# EAGLE design W681A (EAGLE 6.6.0)
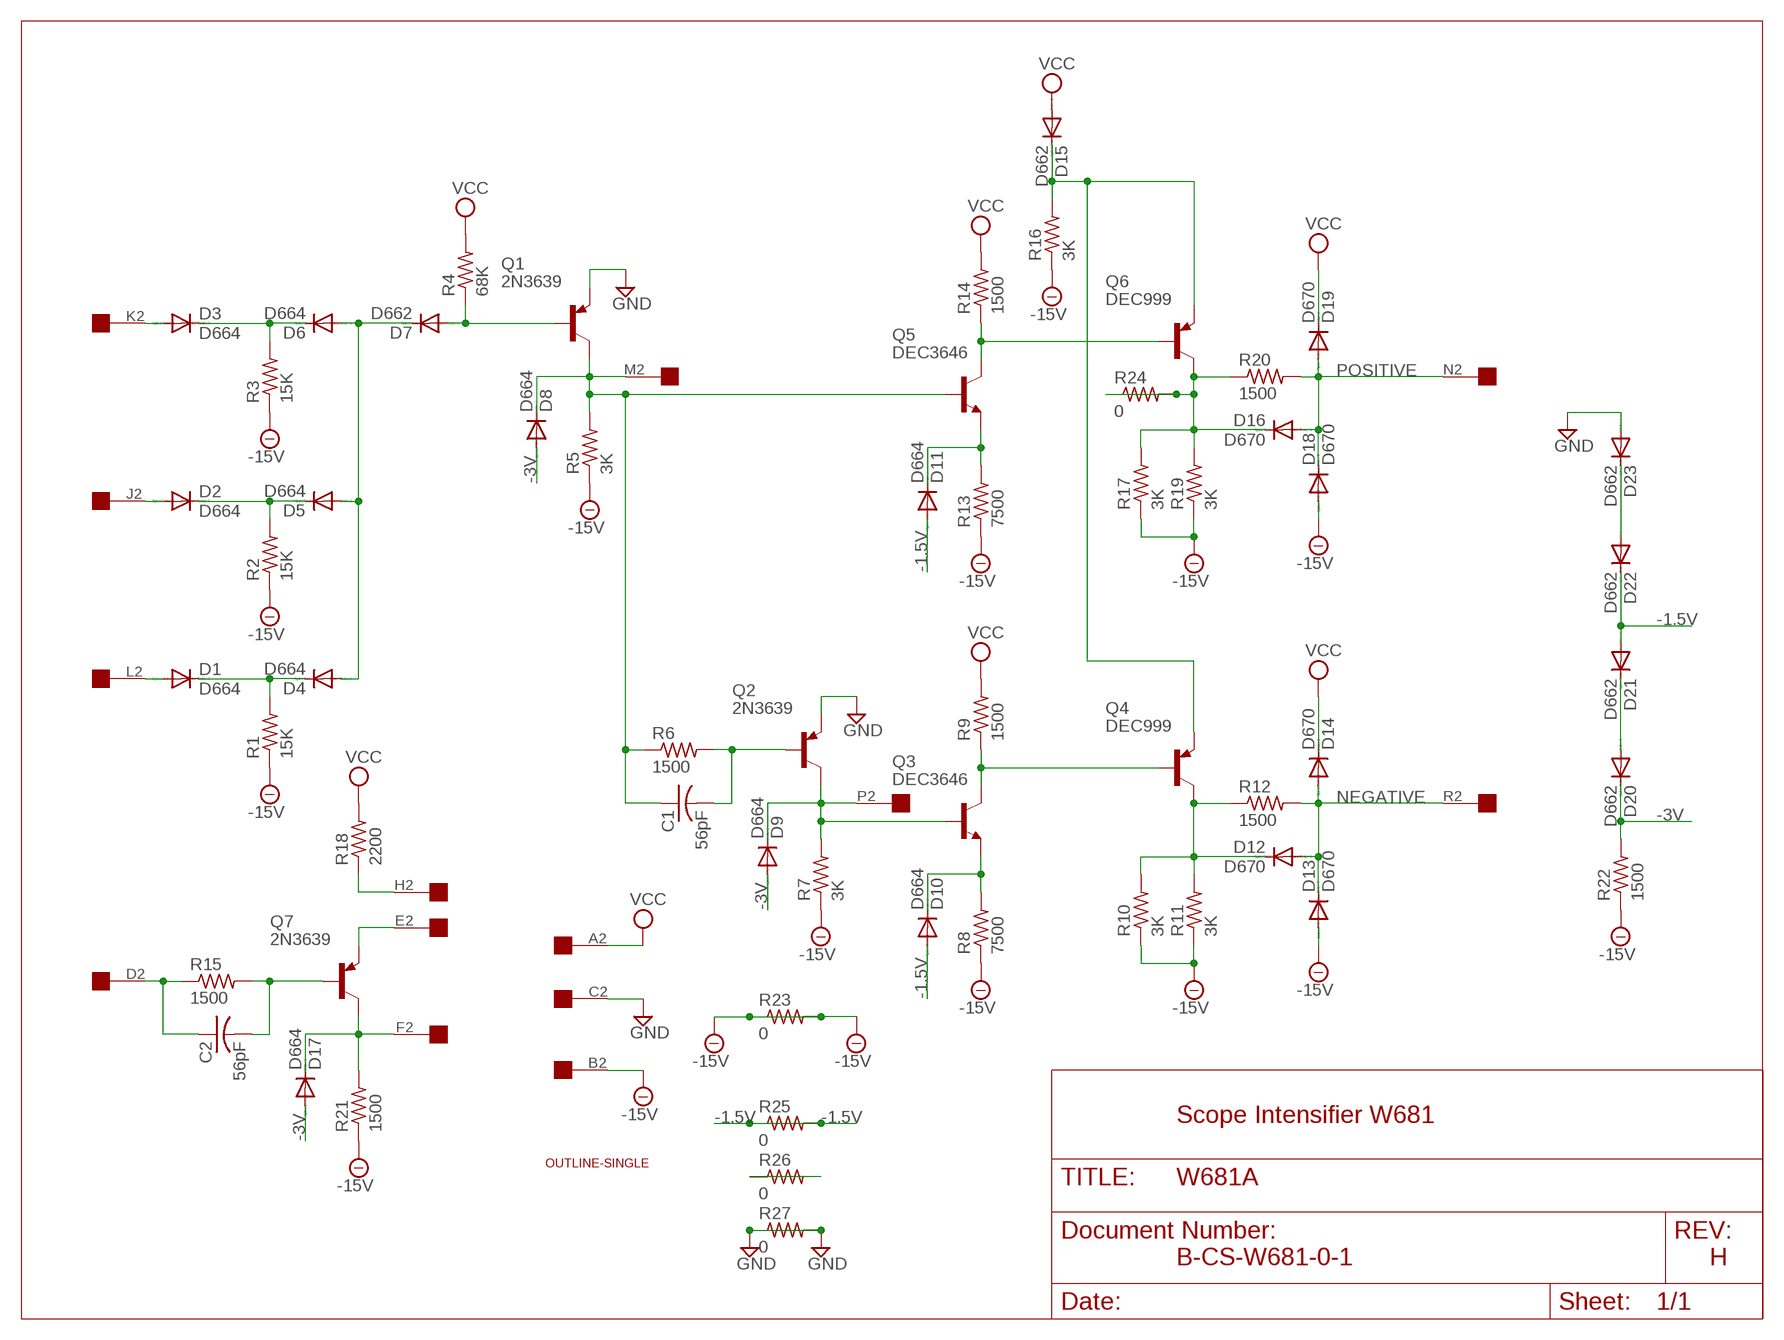
[diagram p0: schematic, sheet 1]

## Parts
C1  56pF  C-US  [C063-025X075]
C2  56pF  C-US  [C063-025X075]
D1  D664  DIODE-DO35-10  [DO35-10]
D2  D664  DIODE-DO35-10  [DO35-10]
D3  D664  DIODE-DO35-10  [DO35-10]
D4  D664  DIODE-DO35-10  [DO35-10]
D5  D664  DIODE-DO35-10  [DO35-10]
D6  D664  DIODE-DO35-10  [DO35-10]
D7  D662  DIODE-DO35-10  [DO35-10]
D8  D664  DIODE-DO35-10  [DO35-10]
D9  D664  DIODE-DO35-10  [DO35-10]
D10  D664  DIODE-DO35-10  [DO35-10]
D11  D664  DIODE-DO35-10  [DO35-10]
D12  D670  DIODE-DO35-10  [DO35-10]
D13  D670  DIODE-DO35-10  [DO35-10]
D14  D670  DIODE-DO35-10  [DO35-10]
D15  D662  DIODE-DO35-10  [DO35-10]
D16  D670  DIODE-DO35-10  [DO35-10]
D17  D664  DIODE-DO35-10  [DO35-10]
D18  D670  DIODE-DO35-10  [DO35-10]
D19  D670  DIODE-DO35-10  [DO35-10]
D20  D662  DIODE-DO35-10  [DO35-10]
D21  D662  DIODE-DO35-10  [DO35-10]
D22  D662  DIODE-DO35-10  [DO35-10]
D23  D662  DIODE-DO35-10  [DO35-10]
Q1  2N3639  -PNP-TO5  [TO5]
Q2  2N3639  -PNP-TO5  [TO5]
Q3  DEC3646  -NPN-TO5  [TO5]
Q4  DEC999  -PNP-TO5  [TO5]
Q5  DEC3646  -NPN-TO5  [TO5]
Q6  DEC999  -PNP-TO5  [TO5]
Q7  2N3639  -PNP-TO5  [TO5]
R1  15K  R-US_0207/10  [0207/10]
R2  15K  R-US_0207/10  [0207/10]
R3  15K  R-US_0207/10  [0207/10]
R4  68K  R-US_0207/10  [0207/10]
R5  3K  R-US_0207/10  [0207/10]
R6  1500  R-US_0207/10  [0207/10]
R7  3K  R-US_0207/10  [0207/10]
R8  7500  R-US_0207/10  [0207/10]
R9  1500  R-US_0207/10  [0207/10]
R10  3K  R-US_0207/10  [0207/10]
R11  3K  R-US_0207/10  [0207/10]
R12  1500  R-US_0207/10  [0207/10]
R13  7500  R-US_0207/10  [0207/10]
R14  1500  R-US_0207/10  [0207/10]
R15  1500  R-US_0207/10  [0207/10]
R16  3K  R-US_0207/10  [0207/10]
R17  3K  R-US_0207/10  [0207/10]
R18  2200  R-US_0207/10  [0207/10]
R19  3K  R-US_0207/10  [0207/10]
R20  1500  R-US_0207/10  [0207/10]
R21  1500  R-US_0207/10  [0207/10]
R22  1500  R-US_0207/10  [0207/10]
R23  0  R-US_0207/10  [0207/10]
R24  0  R-US_0207/10  [0207/10]
R25  0  R-US_0207/10  [0207/10]
R26  0  R-US_0207/10  [0207/10]
R27  0  R-US_0207/10  [0207/10]
U$1  OUTLINE-SINGLE  [SINGLE]
U$2  EDGE-1  [EDGE-CON1]

## Nets
-1.5V [supply]: D10.A D11.A D21.A D22.C R25.1 R25.2
-3V: D8.A D9.A D17.A D20.C R22.2
-15V [supply]: D13.A D18.A R1.1 R2.1 R3.1 R5.1 R7.1 R8.1 R10.1 R11.1 R13.1 R16.1 R17.1 R19.1 R21.1 R22.1 R23.1 R23.2 U$2.B2
GND [supply]: D23.A Q1.1(E) Q2.1(E) R27.1 R27.2 U$2.C2
N$1: D1.A U$2.L2
N$2: D2.A U$2.J2
N$3: D3.A U$2.K2
N$4: D1.C D4.C R1.2
N$5: D2.C D5.C R2.2
N$6: D3.C D6.C R3.2
N$7: D4.A D5.A D6.A D7.C
N$8: D7.A Q1.2(B) R4.1
N$9: C1.1 D8.C Q1.3(C) Q5.2(B) R5.2 R6.1 U$2.M2
N$10: C1.2 Q2.2(B) R6.2
N$11: D9.C Q2.3(C) Q3.2(B) R7.2 U$2.P2
N$12: Q3.3(C) Q4.2(B) R9.1
N$13: D10.C Q3.1(E) R8.2
N$14: D12.C Q4.3(C) R10.2 R11.2 R12.1
N$15: Q5.3(C) Q6.2(B) R14.1
N$16: D11.C Q5.1(E) R13.2
N$17: D15.C Q4.1(E) Q6.1(E) R16.2
N$18: D16.C Q6.3(C) R17.2 R19.2 R20.1 R24.1 R24.2
N$19: C2.1 R15.1 U$2.D2
N$20: C2.2 Q7.2(B) R15.2
N$21: D17.C Q7.3(C) R21.2 U$2.F2
N$22: Q7.1(E) U$2.E2
N$23: R18.1 U$2.H2
N$25: D20.A D21.C
N$26: D22.A D23.C
N$27: R26.1 R26.2
NEGATIVE: D12.A D13.C D14.A R12.2 U$2.R2
POSITIVE: D16.A D18.C D19.A R20.2 U$2.N2
VCC [supply]: D14.C D15.A D19.C R4.2 R9.2 R14.2 R18.2 U$2.A2
Unconnected: U$2.S2 U$2.T2 U$2.U2 U$2.V2

## Notes on the sheet
- Scope Intensifier W681
- B-CS-W681-0-1 | H

## Library data of the parts
C1 C2 = dec-con:C-US: Capacitors with funky DEC lead spacing.
D1-D23 = diode:DIODE-: DIODE
Q1 Q2 Q4 Q6 Q7 = transistor:*-PNP-: PNP Transistror
Q3 Q5 = transistor:*-NPN-: NPN Transistror BF959 corrected 2008.03.06
R1-R27 = rcl:R-US_: RESISTOR, American symbol
U$1 = dec-con:OUTLINE-*: Board outlines for DEC boards.
U$2 = dec-con:EDGE-1: Single-Sided DEC Edge Connector -- (side 2)

## Net classes
1 supply: width 0.813 mm

## Board
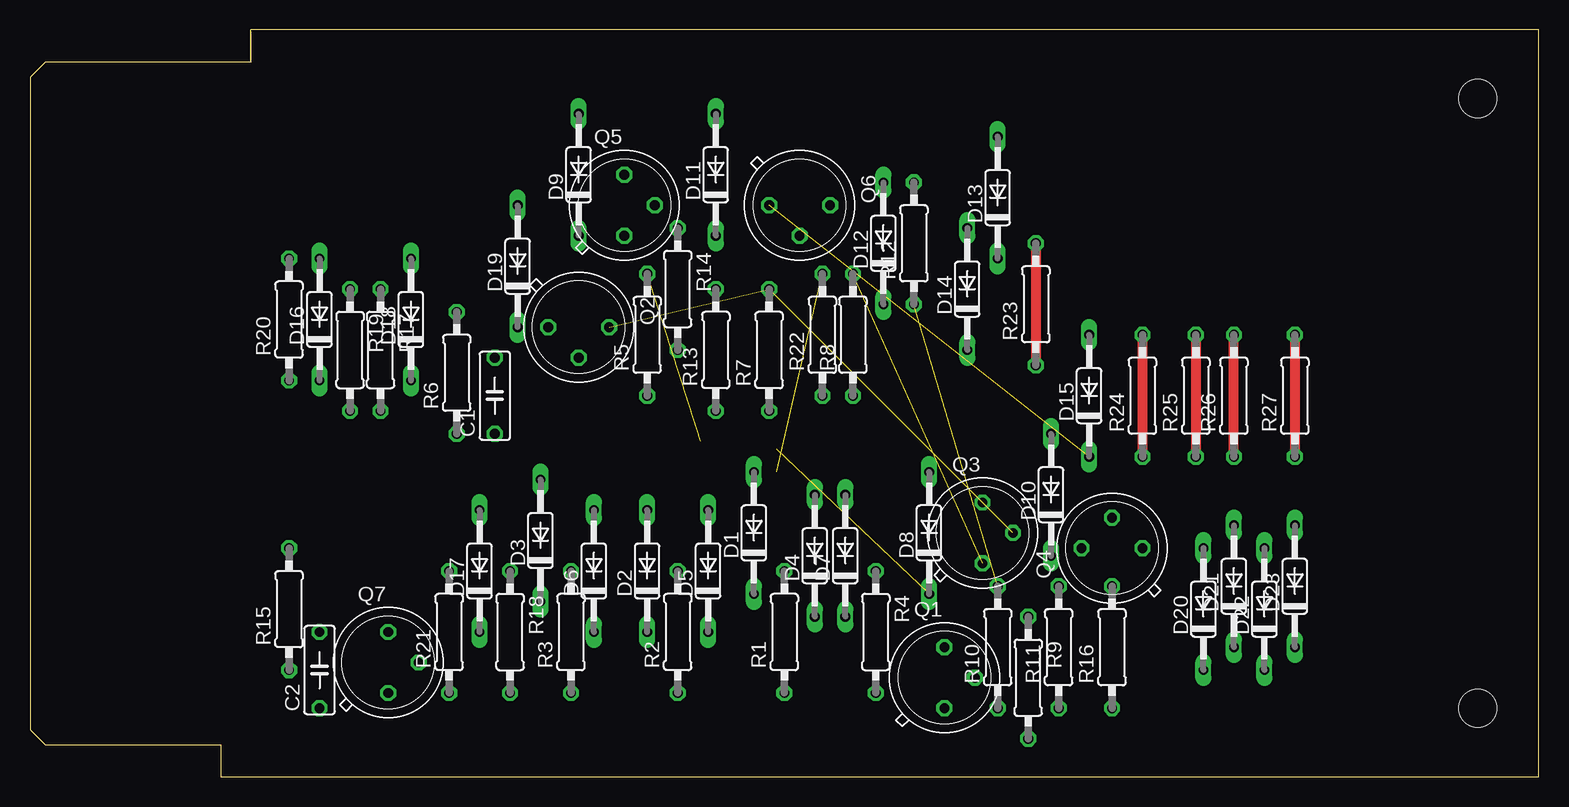
[diagram p1: board, top side]
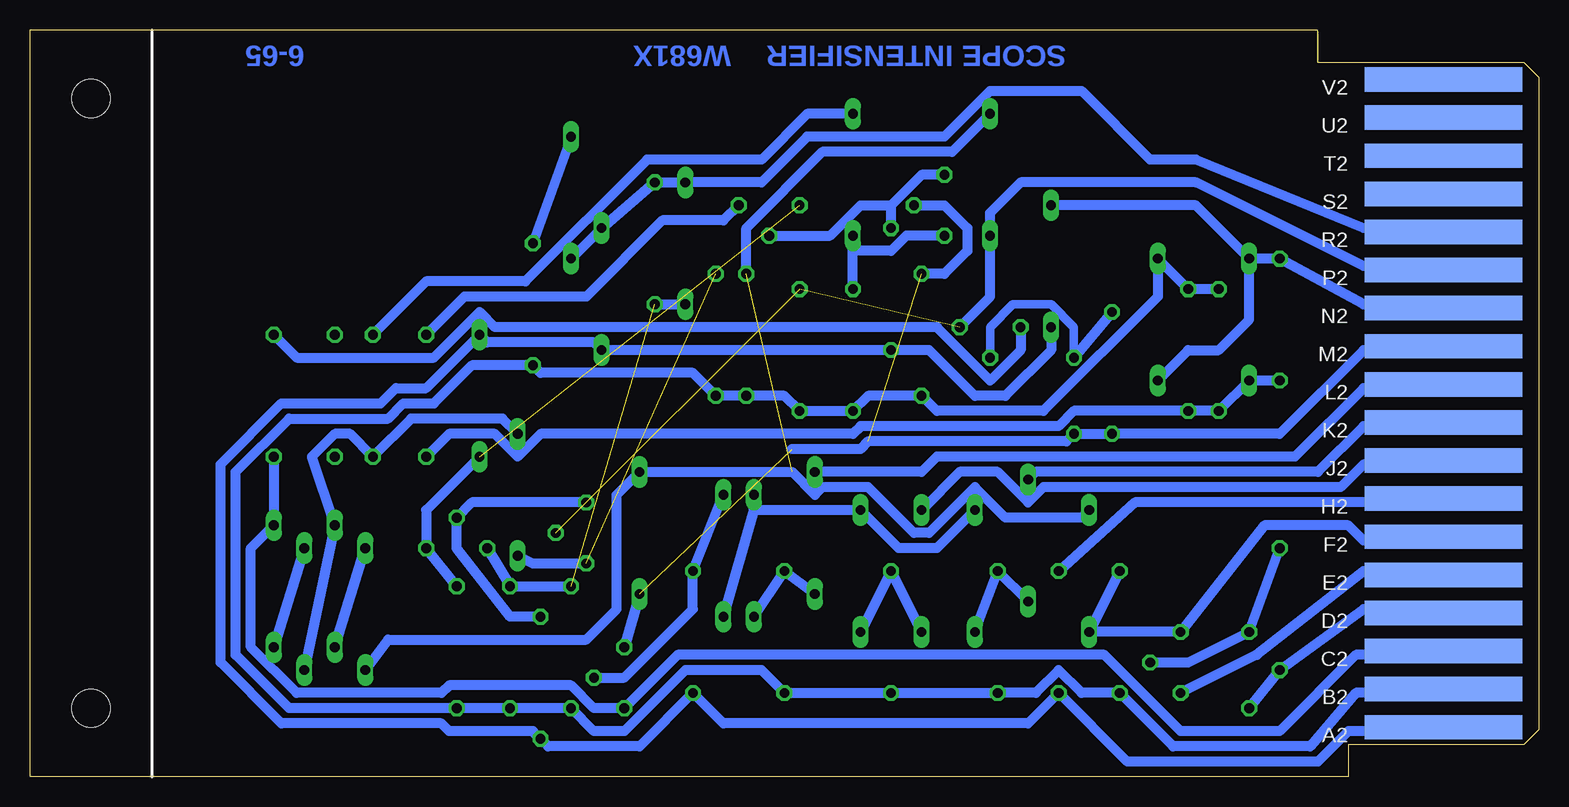
[diagram p2: board, bottom side, seen from below]

Size 125.73 x 62.23 mm. Coordinates in mm from the lower left corner, seen from the top.
Copper layers (1+16): Top 0.035mm / dielectric 1.5mm / Bottom 0.035mm
Design rules "16mils": minimum track width 16mil, minimum drill 32mil, track to track 15mil, track to pad 10mil, pad to pad 10mil, via to via 10mil, smd to smd 10mil, copper to edge 13mil, drill to drill 10mil, minimum pad ring 10mil, minimum via ring 8mil, stop-mask expansion 0mil, vias tented up to drill 0mil, thermal gap 10mil

### Footprints (pad centres in the part's own frame; a part is rotated, then mirrored left to right if it is on the bottom)
C063-025X075 = drill 0.813 octagon: 1 -2.54,0; 2 3.81,0
DO35-10 = drill 0.813 long: A 5.08,0; C -5.08,0
TO5 = drill 0.813 octagon: 1 0,-2.54; 2 2.54,0; 3 0,2.54
0207/10 = drill 0.813 octagon: 1 -5.08,0; 2 5.08,0
SINGLE = hole 3.175: 120.65,56.515; 120.65,5.715
EDGE-CON1 = smd 13.106 x 2.032 bottom: A2 7.938,4.128; B2 7.938,7.303; C2 7.938,10.477; D2 7.938,13.652; E2 7.938,16.828; F2 7.938,20.003; H2 7.938,23.177; J2 7.938,26.352; K2 7.938,29.527; L2 7.938,32.703; M2 7.938,35.877; N2 7.938,39.053; P2 7.938,42.227; R2 7.938,45.403; S2 7.938,48.578; T2 7.938,51.752; U2 7.938,54.928; V2 7.938,58.102

### Placement (x,y rotation side)
C1  38.74,31.11 90 top
C2  24.13,8.26 90 top
D1  60.33,20.32 90 top
D2  51.44,17.14 90 top
D3  42.55,19.68 90 top
D4  65.41,18.41 90 top
D5  56.52,17.14 90 top
D6  46.99,17.14 90 top
D7  67.95,18.41 90 top
D8  74.93,20.32 90 top
D9  45.72,50.16 90 top
D10  85.09,23.5 90 top
D11  57.15,50.16 90 top
D12  71.12,44.45 90 top
D13  80.65,48.26 90 top
D14  78.11,40.64 90 top
D15  88.27,31.75 90 top
D16  24.13,38.1 90 top
D17  37.47,17.14 90 top
D18  31.75,38.1 90 top
D19  40.64,42.55 90 top
D20  97.79,13.97 90 top
D21  100.33,15.88 90 top
D22  102.87,13.97 90 top
D23  105.41,15.88 90 top
Q1  76.2,8.26 0 top
Q2  45.72,37.47 270 top
Q3  79.38,20.32 0 top
Q4  90.17,19.05 90 top
Q5  49.53,47.62 0 top
Q6  64.14,47.62 270 top
Q7  29.85,9.53 0 top
R1  62.87,12.06 90 top
R2  53.98,12.06 90 top
R3  45.09,12.06 90 top
R4  70.49,12.06 270 top
R5  51.44,36.83 90 top
R6  35.56,33.66 90 top
R7  61.6,35.56 90 top
R8  68.58,36.83 90 top
R9  83.19,8.26 270 top
R10  80.65,10.79 90 top
R11  85.73,10.79 90 top
R12  73.66,44.45 90 top
R13  57.15,35.56 90 top
R14  53.98,40.64 270 top
R15  21.59,13.97 90 top
R16  90.17,10.79 90 top
R17  29.21,35.56 270 top
R18  40.01,12.06 270 top
R19  26.67,35.56 270 top
R20  21.59,38.1 90 top
R21  34.93,12.06 90 top
R22  66.04,36.83 90 top
R23  83.82,39.37 90 top
R24  92.71,31.75 90 top
R25  97.16,31.75 90 top
R26  100.33,31.75 90 top
R27  105.41,31.75 90 top
U$1  0,0 0 top
U$2  0,0 0 top

### Tracks (layer width: path | path; a pad name or v marks a point on that pad's centre or on a via)
-1.5V
  Top 0.813: R25.2 R25.1
  Bottom 0.813: D22.C D21.A 102.24,26.67 100.33,28.57 99.06,28.57 R25.1 93.98,29.84 86.36,29.84 D10.A | D11.A 60.96,55.24 64.77,51.44 74.3,51.44 84.46,41.27 92.71,41.27 R25.2
-3V  (1 unrouted)
  Bottom 0.813: D20.C 95.89,11.43 79.38,11.43 76.84,13.97 76.84,23.5 D8.A 62.23,25.4 60.33,23.5 59.69,24.13 55.88,24.13 52.07,20.32 50.8,20.32 46.99,24.13 44.45,21.59 38.1,21.59 D17.A | D9.A 48.9,52.07 59.69,52.07 66.04,45.72 R22.2
-15V
  Top 0.813: R23.2 R23.1
  Bottom 0.813: U$2.B2 8.26,6.99 15.24,6.99 19.05,2.54 30.48,2.54 R21.1 38.1,6.99 40.01,8.89 41.91,6.99 R3.1 R2.1 R1.1 64.77,8.89 71.12,8.89 76.2,3.81 78.74,3.81 R10.1 R11.1 R16.1 104.14,5.71 108.59,10.16 108.59,25.4 104.14,29.84 95.89,29.84 94.62,31.11 92.08,31.11 88.9,34.29 R23.1 83.19,33.66 70.49,33.66 R8.1 R22.1 62.87,31.75 R7.1 R13.1 55.88,31.75 R5.1 50.17,30.48 41.28,30.48 31.75,40.01 D18.A R17.1 R19.1 | D13.A R23.2
GND
  Top 0.813: R27.2 R27.1
  Bottom 0.813: U$2.C2 8.89,10.16 15.24,10.16 21.59,3.81 29.85,3.81 36.2,10.16 71.76,10.16 Q1.1 78.74,5.71 80.65,7.62 90.81,7.62 91.44,6.99 103.51,6.99 107.32,10.79 107.32,19.05 D23.A R27.1 | Q2.1 43.18,35.56 45.72,33.02 50.17,37.47 87,37.47 88.27,38.73 92.08,34.92 103.51,34.92 R27.2
N$1
  Bottom 0.813: U$2.L2 8.89,32.38 14.61,32.38 20.32,26.67 50.17,26.67 51.44,25.4 D1.A
N$2
  Bottom 0.813: U$2.J2 8.89,26.04 14.61,26.04 16.51,24.13 41.28,24.13 42.55,22.86 45.09,25.4 48.26,25.4 D2.A
N$3
  Bottom 0.813: U$2.K2 8.26,29.21 14.61,29.21 18.42,25.4 41.91,25.4 D3.A
N$4
  Bottom 0.813: D1.C R1.2 D4.C
N$5
  Bottom 0.813: D2.C R2.2 D5.C
N$6
  Bottom 0.813: D3.C R3.2 D6.C
N$7
  Bottom 0.813: 65.41,22.23 D7.C | D6.A 50.17,19.05 53.34,19.05 D5.A 65.41,22.23 | 65.41,22.23 D4.A
N$8
  Bottom 0.813: Q1.2 76.2,8.26 70.49,13.97 R4.1 D7.A
N$9  (2 unrouted)
  Bottom 0.813: D8.C Q1.3 | U$2.M2 8.89,35.56 14.61,35.56 21.59,28.57 R6.1 C1.1 39.37,27.94 55.88,27.94 56.52,27.3 62.23,27.3 | Q5.2 49.53,47.62 47.63,45.72 47.63,43.81 49.53,41.91 R5.2
N$10
  Bottom 0.711: C1.2 38.74,37.47 40.64,39.37 43.82,39.37 45.72,37.47 Q2.2
  Bottom 0.813: R6.2 C1.2
N$11  (2 unrouted)
  Bottom 0.813: U$2.P2 8.89,42.55 14.61,42.55 28.58,49.53 43.18,49.53 45.72,46.99 D9.C 45.72,40.01 Q2.3
N$12
  Bottom 0.813: Q3.3 88.9,22.86 Q4.2 90.17,19.05 85.73,13.34 R9.1
N$13  (1 unrouted)
  Bottom 0.813: D10.C 83.82,17.78 Q3.1
N$14  (1 unrouted)
  Bottom 0.813: R10.2 R11.2 Q4.3 | R12.1 D12.C
N$15
  Bottom 0.813: Q5.3 51.44,50.16 53.98,47.62 | R14.1 53.98,47.62 | Q6.2 59.06,45.09 56.52,47.62 53.98,47.62
N$16
  Bottom 0.813: Q5.1 52.71,45.09 53.98,43.81 57.15,43.81 | R13.2 57.15,43.81 | 57.15,43.81 D11.C
N$17  (1 unrouted)
  Bottom 0.813: R16.2 Q4.1 92.71,22.23 D15.C
N$18
  Top 0.813: R24.1 R24.2
  Bottom 0.813: R20.1 D16.C R19.2 R17.2 38.74,30.48 40.01,29.21 56.52,29.21 57.15,28.57 83.19,28.57 85.09,26.67 87,28.57 90.81,28.57 R24.1 | Q6.3 67.95,46.35 73.03,46.35 79.38,40.01 89.54,40.01 R24.2
N$19
  Bottom 0.813: C2.1 R15.1 14.61,13.97 8.89,13.97 U$2.D2
N$20
  Bottom 0.813: R15.2 C2.2 29.21,9.53 Q7.2
N$21
  Bottom 0.813: U$2.F2 8.89,19.68 14.61,19.68 15.88,20.95 22.86,20.95 Q7.3 D17.C R21.2
N$22
  Bottom 0.813: U$2.E2 8.26,17.14 14.61,17.14 23.5,10.16 Q7.1
N$23
  Bottom 0.813: U$2.H2 9.53,22.86 33.66,22.86 R18.1
N$25
  Bottom 0.813: D21.C D20.A
N$26
  Bottom 0.813: D22.A D23.C
N$27
  Top 0.813: R26.1 R26.2
NEGATIVE
  Bottom 0.813: U$2.R2 8.89,45.72 14.61,45.72 28.58,51.44 32.39,51.44 38.1,57.15 45.72,57.15 49.53,53.34 60.96,53.34 64.77,49.53 D12.A R12.2 D14.A D13.C
POSITIVE
  Bottom 0.813: U$2.N2 8.26,39.37 14.61,39.37 R20.2 D16.A | D19.A 28.58,47.62 D16.A | D18.C 29.21,35.56 26.67,35.56 24.13,38.1 D16.A
VCC
  Bottom 0.813: U$2.A2 8.26,3.81 15.88,3.81 18.42,1.27 34.29,1.27 R18.2 42.55,4.45 67.95,4.45 R4.2 74.93,2.54 82.55,2.54 R9.2 83.82,3.81 90.81,3.81 91.44,4.45 104.78,4.45 109.86,9.53 109.86,26.04 104.78,31.11 96.52,31.11 95.25,32.38 92.71,32.38 D15.A 87.63,36.2 78.74,36.2 D14.C R14.2 50.8,35.56 46.99,31.75 44.45,31.75 40.64,35.56 D19.C

### Text on the board
Bottom: SCOPE INTENSIFIER | W681X | 6-65